# Altium schematic sheet L6225_MotorDriver_.SchDoc
size B
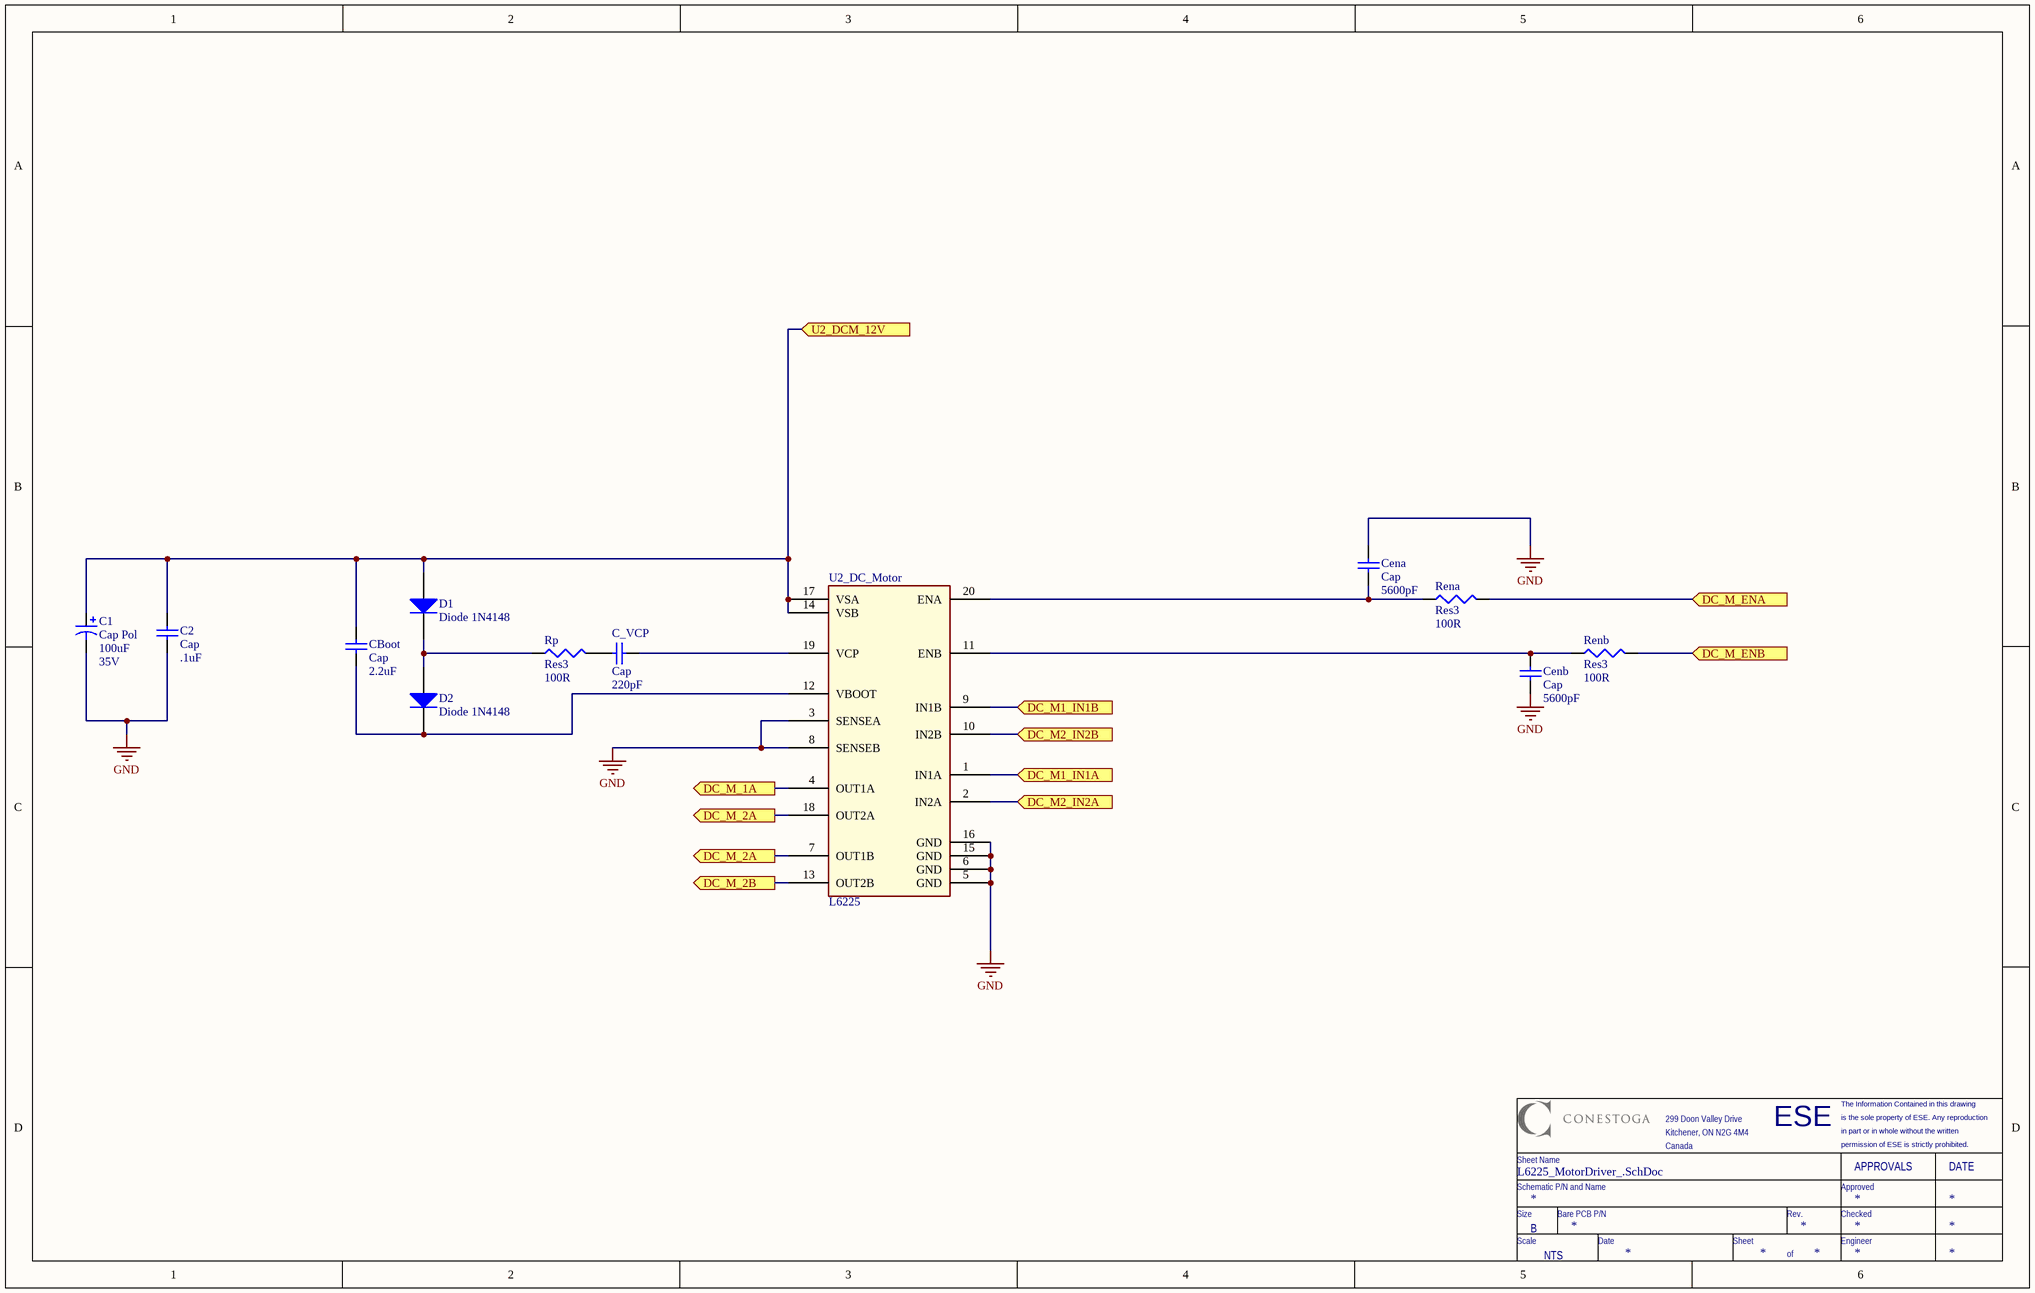
[diagram p0: L6225_MotorDriver_.SchDoc]

## Parts
C1  Cap Pol  value 100uF  Voltage: 35V  [CAPACITOR_6.3MM]
C2  Cap  value .1uF  [CAPC2012X09M]
C_VCP  Cap  value 220pF  [CAPC2012X09M]
CBoot  Cap  value 2.2uF  [CAPC2012X09M]
Cena  Cap  value 5600pF  [CAPC2012X09M]
Cenb  Cap  value 5600pF  [CAPC2012X09M]
D1  Diode 1N4148  [zener_sod323]
D2  Diode 1N4148  [zener_sod323]
Rena  Res3  value 100R  [RESC2112X05M]
Renb  Res3  value 100R  [RESC2112X05M]
Rp  Res3  value 100R  [RESC2112X05M]
U2_DC_Motor  L6225  [POWERSOP20]

## Ports
DC_M1_IN1A (in), DC_M1_IN1B (in), DC_M2_IN2A (in), DC_M2_IN2B (in), DC_M_1A (out), DC_M_2A (out), DC_M_2B (out), DC_M_ENA (in), DC_M_ENB (in), U2_DCM_12V (in)

## Nets
GND: C1.2 C2.1 Cena.2 Cenb.1 U2_DC_Motor.3(SENSEA) U2_DC_Motor.5(GND) U2_DC_Motor.6(GND) U2_DC_Motor.8(SENSEB) U2_DC_Motor.15(GND) U2_DC_Motor.16(GND)
DC_M1_IN1A: U2_DC_Motor.1(IN1A) ; port DC_M1_IN1A
DC_M1_IN1B: U2_DC_Motor.9(IN1B) ; port DC_M1_IN1B
DC_M2_IN2A: U2_DC_Motor.2(IN2A) ; port DC_M2_IN2A
DC_M2_IN2B: U2_DC_Motor.10(IN2B) ; port DC_M2_IN2B
DC_M_1A: U2_DC_Motor.4(OUT1A) ; port DC_M_1A
DC_M_2A: U2_DC_Motor.7(OUT1B) U2_DC_Motor.18(OUT2A) ; port DC_M_2A
DC_M_2B: U2_DC_Motor.13(OUT2B) ; port DC_M_2B
DC_M_ENA: Rena.2 ; port DC_M_ENA
DC_M_ENB: Renb.2 ; port DC_M_ENB
U2_DCM_12V: C1.1 C2.2 CBoot.2 D1.A U2_DC_Motor.14(VSB) U2_DC_Motor.17(VSA) ; port U2_DCM_12V
NetC_VCP_1: C_VCP.1 Rp.2
NetC_VCP_2: C_VCP.2 U2_DC_Motor.19(VCP)
NetCBoot_1: CBoot.1 D2.K U2_DC_Motor.12(VBOOT)
NetCena_1: Cena.1 Rena.1 U2_DC_Motor.20(ENA)
NetCenb_2: Cenb.2 Renb.1 U2_DC_Motor.11(ENB)
NetD1_K: D1.K D2.A Rp.1

## Notes on the sheet
- ESE
- is the sole property of ESE. Any reproduction
- The Information Contained in this drawing
- Schematic P/N and Name
- Sheet Name
- 299 Doon Valley Drive
- Kitchener, ON N2G 4M4
- Canada
- Approved
- in part or in whole without the written
- permission of ESE is strictly prohibited.
- APPROVALS
- DATE
- Size
- Scale
- B
- NTS
- Bare PCB P/N
- Date
- Sheet
- Rev.
- Checked
- Engineer
- of

## Library data of the parts
C1 = Cap Polar-100uF-16V: CAP 85C 100uF ±20% 16V WX Series Aluminum Electrolytic; MPN: UWX1C101MCL1GB; Tan Theta: 0.16; Leakage Current: 16; Rated Ripple Current: 86; PN: 493-2105-1-ND; Name: Cap Polar-100uF-16V; Diameter: 6.3; URL: http://www.digikey.ca/product-detail/en/UWX1C101MCL1GB/493-2105-1-ND; URLZ: http://www.digikey.ca/product-detail/en/UWT1V101MCL1GS/493-2203-1-ND/590178
C2 = CAP-X7R-.1uF-100V-±10%: CAP CER .1uF 100v X7R 0805; MPN: C0805C104K1RACTU; PN: 399-3486-1-ND; Name: CAP-X7R-.1uF-100V-±10%; URL: http://www.digikey.ca/product-detail/en/C0805C104K1RACTU/399-3486-1-ND
C_VCP = CAP-COG-220pF-50V-±5%: CAP CER 220pF 50v COG 0805; MPN: C0805C221J5GACTU; PN: 399-1127-1-ND; Name: CAP-COG-220pF-50V-±5%; URL: http://www.digikey.ca/product-detail/en/C0805C221J5GACTU/399-1127-1-ND
CBoot = CAP-X7R-2.2uF-16V-±10%: CAP CER 2.2uF 16v X7R 0805; MPN: C0805C225K4RACTU; PN: 399-3523-1-ND; Name: CAP-X7R-2.2uF-16V-±10%; URL: http://www.digikey.ca/product-detail/en/C0805C225K4RACTU/399-3523-1-ND
Cena Cenb = CAP-X7R-5600pF-50V-±10%: CAP CER 5600pF 50v X7R 0805; MPN: C0805C562K5RACTU; PN: 399-1156-1-ND; Name: CAP-X7R-5600pF-50V-±10%; URL: http://www.digikey.ca/product-detail/en/C0805C562K5RACTU/399-1156-1-ND
D1 D2 = Diode 1N4148: High Conductance Fast Diode; PN: 1N4148WXTPMSCT-ND; URL: http://www.digikey.ca/product-detail/en/1N4148WX-TP/1N4148WXTPMSCT-ND/717312
Rena Renb Rp = Resistor_100R: RES SMD 100R OHM 1% 1/8W 0805; MPN: CRCW0805100RFKEA; PN: 541-100CCT-ND; Name: Resistor_100R; URL: http://www.digikey.ca/product-detail/en/CRCW0805100RFKEA/541-100CCT-ND
U2_DC_Motor = L6225: IC MOTOR DRIVER PAR 20POWERSO; MPN: L6225PDTR; PN: 497-5345-1-ND; URL: http://www.digikey.ca/product-detail/en/L6225PDTR/497-5345-1-ND